# Altium schematic sheet ECAL-TEST-RIGHT-ISOLATION.SchDoc
size A; SheetNumber: 5; SheetTotal: 5
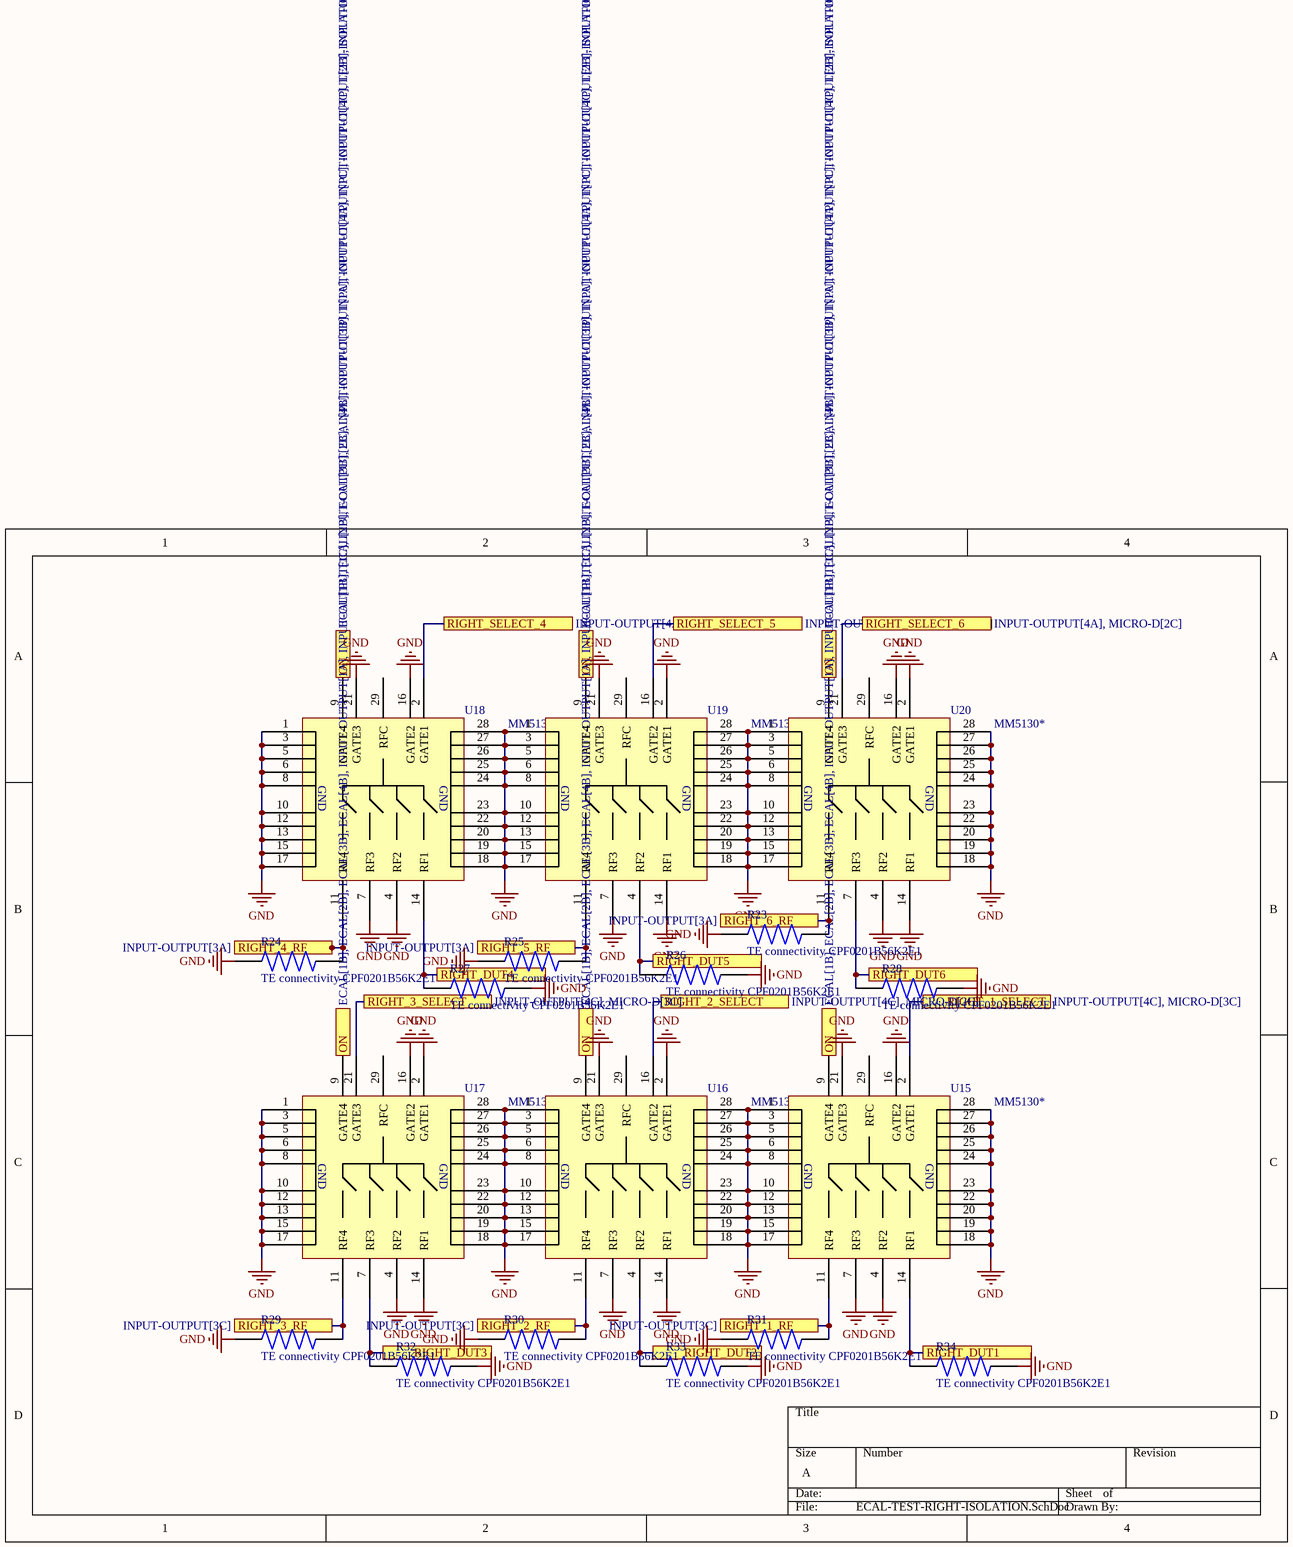
[diagram p0: ECAL-TEST-RIGHT-ISOLATION.SchDoc]

## Parts
R23  TE connectivity CPF0201B56K2E1  [0201-resistor]
R24  TE connectivity CPF0201B56K2E1  [0201-resistor]
R25  TE connectivity CPF0201B56K2E1  [0201-resistor]
R26  TE connectivity CPF0201B56K2E1  [0201-resistor]
R27  TE connectivity CPF0201B56K2E1  [0201-resistor]
R28  TE connectivity CPF0201B56K2E1  [0201-resistor]
R29  TE connectivity CPF0201B56K2E1  [0201-resistor]
R30  TE connectivity CPF0201B56K2E1  [0201-resistor]
R31  TE connectivity CPF0201B56K2E1  [0201-resistor]
R32  TE connectivity CPF0201B56K2E1  [0201-resistor]
R33  TE connectivity CPF0201B56K2E1  [0201-resistor]
R34  TE connectivity CPF0201B56K2E1  [0201-resistor]
U15  MM5130*  [MM5130-NORM_PCB_NOFLOOD]
U16  MM5130*  [MM5130-NORM_PCB_NOFLOOD]
U17  MM5130*  [MM5130-NORM_PCB_NOFLOOD]
U18  MM5130*  [MM5130-NORM_PCB_NOFLOOD]
U19  MM5130*  [MM5130-NORM_PCB_NOFLOOD]
U20  MM5130*  [MM5130-NORM_PCB_NOFLOOD]

## Ports
ON (see ECAL[1B], ECAL[2B], ECAL[3B], ECAL[4B], INPUT-OUTPUT[1A], INPUT-OUTPUT[1C], INPUT-OUTPUT[2B], INPUT-OUTPUT[3B], INPUT-OUTPUT[4A], INPUT-OUTPUT[4C], LEFT-ISOLATION[1A], LEFT-ISOLATION[1C], LEFT-ISOLATION[2A], LEFT-ISOLATION[2C], LEFT-ISOLATION[3A], LEFT-ISOLATION[3C], MICRO-D[2C], RIGHT-ISOLATION[2A], RIGHT-ISOLATION[2C], RIGHT-ISOLATION[3A]), ON (see ECAL[1B], ECAL[2B], ECAL[3B], ECAL[4B], INPUT-OUTPUT[1A], INPUT-OUTPUT[1C], INPUT-OUTPUT[2B], INPUT-OUTPUT[3B], INPUT-OUTPUT[4A], INPUT-OUTPUT[4C], LEFT-ISOLATION[1A], LEFT-ISOLATION[1C], LEFT-ISOLATION[2A], LEFT-ISOLATION[2C], LEFT-ISOLATION[3A], LEFT-ISOLATION[3C], MICRO-D[2C], RIGHT-ISOLATION[2A], RIGHT-ISOLATION[2C], RIGHT-ISOLATION[3A], RIGHT-ISOLATION[3C]), ON (see ECAL[1B], ECAL[2B], ECAL[3B], ECAL[4B], INPUT-OUTPUT[1A], INPUT-OUTPUT[1C], INPUT-OUTPUT[2B], INPUT-OUTPUT[3B], INPUT-OUTPUT[4A], INPUT-OUTPUT[4C], LEFT-ISOLATION[1A], LEFT-ISOLATION[1C], LEFT-ISOLATION[2A], LEFT-ISOLATION[2C], LEFT-ISOLATION[3A], LEFT-ISOLATION[3C], MICRO-D[2C], RIGHT-ISOLATION[2A], RIGHT-ISOLATION[2C], RIGHT-ISOLATION[3C]), RIGHT_1_RF (see INPUT-OUTPUT[3C]), RIGHT_1_SELECT (see INPUT-OUTPUT[4C], MICRO-D[3C]), RIGHT_2_RF (see INPUT-OUTPUT[3C]), RIGHT_2_SELECT (see INPUT-OUTPUT[4C], MICRO-D[2C]), RIGHT_3_RF (see INPUT-OUTPUT[3C]), RIGHT_3_SELECT (see INPUT-OUTPUT[4C], MICRO-D[3C]), RIGHT_4_RF (see INPUT-OUTPUT[3A]), RIGHT_5_RF (see INPUT-OUTPUT[3A]), RIGHT_6_RF (see INPUT-OUTPUT[3A]), RIGHT_DUT1, RIGHT_DUT2, RIGHT_DUT3, RIGHT_DUT4, RIGHT_DUT5, RIGHT_DUT6, RIGHT_SELECT_4 (see INPUT-OUTPUT[4A], MICRO-D[2C]), RIGHT_SELECT_5 (see INPUT-OUTPUT[4A], MICRO-D[3C]), RIGHT_SELECT_6 (see INPUT-OUTPUT[4A], MICRO-D[2C])

## Nets
GND: R23.1 R24.1 R25.1 R26.1 R27.1 R28.1 R29.1 R30.1 R31.1 R32.1 R33.1 R34.1 U15.1(GND) U15.3(GND) U15.4(RF2) U15.5(GND) U15.6(GND) U15.7(RF3) U15.8(GND) U15.10(GND) U15.12(GND) U15.13(GND) U15.15(GND) U15.16(GATE2) U15.17(GND) U15.18(GND) U15.19(GND) U15.20(GND) U15.21(GATE3) U15.22(GND) U15.23(GND) U15.24(GND) U15.25(GND) U15.26(GND) U15.27(GND) U15.28(GND) U16.1(GND) U16.2(GATE1) U16.3(GND) U16.5(GND) U16.6(GND) U16.7(RF3) U16.8(GND) U16.10(GND) U16.12(GND) U16.13(GND) U16.14(RF1) U16.15(GND) U16.17(GND) U16.18(GND) U16.19(GND) U16.20(GND) U16.21(GATE3) U16.22(GND) U16.23(GND) U16.24(GND) U16.25(GND) U16.26(GND) U16.27(GND) U16.28(GND) U17.1(GND) U17.2(GATE1) U17.3(GND) U17.4(RF2) U17.5(GND) U17.6(GND) U17.8(GND) U17.10(GND) U17.12(GND) U17.13(GND) U17.14(RF1) U17.15(GND) U17.16(GATE2) U17.17(GND) U17.18(GND) U17.19(GND) U17.20(GND) U17.22(GND) U17.23(GND) U17.24(GND) U17.25(GND) U17.26(GND) U17.27(GND) U17.28(GND) U18.1(GND) U18.3(GND) U18.4(RF2) U18.5(GND) U18.6(GND) U18.7(RF3) U18.8(GND) U18.10(GND) U18.12(GND) U18.13(GND) U18.15(GND) U18.16(GATE2) U18.17(GND) U18.18(GND) U18.19(GND) U18.20(GND) U18.21(GATE3) U18.22(GND) U18.23(GND) U18.24(GND) U18.25(GND) U18.26(GND) U18.27(GND) U18.28(GND) U19.1(GND) U19.2(GATE1) U19.3(GND) U19.5(GND) U19.6(GND) U19.7(RF3) U19.8(GND) U19.10(GND) U19.12(GND) U19.13(GND) U19.14(RF1) U19.15(GND) U19.17(GND) U19.18(GND) U19.19(GND) U19.20(GND) U19.21(GATE3) U19.22(GND) U19.23(GND) U19.24(GND) U19.25(GND) U19.26(GND) U19.27(GND) U19.28(GND) U20.1(GND) U20.2(GATE1) U20.3(GND) U20.4(RF2) U20.5(GND) U20.6(GND) U20.8(GND) U20.10(GND) U20.12(GND) U20.13(GND) U20.14(RF1) U20.15(GND) U20.16(GATE2) U20.17(GND) U20.18(GND) U20.19(GND) U20.20(GND) U20.22(GND) U20.23(GND) U20.24(GND) U20.25(GND) U20.26(GND) U20.27(GND) U20.28(GND)
ON: U15.9(GATE4) U16.9(GATE4) U17.9(GATE4) U18.9(GATE4) U19.9(GATE4) U20.9(GATE4) ; port ON
RIGHT_1_RF: R31.2 U15.11(RF4) ; port RIGHT_1_RF
RIGHT_1_SELECT: U15.2(GATE1) ; port RIGHT_1_SELECT
RIGHT_2_RF: R30.2 U16.11(RF4) ; port RIGHT_2_RF
RIGHT_2_SELECT: U16.16(GATE2) ; port RIGHT_2_SELECT
RIGHT_3_RF: R29.2 U17.11(RF4) ; port RIGHT_3_RF
RIGHT_3_SELECT: U17.21(GATE3) ; port RIGHT_3_SELECT
RIGHT_4_RF: R24.2 U18.11(RF4) ; port RIGHT_4_RF
RIGHT_5_RF: R25.2 U19.11(RF4) ; port RIGHT_5_RF
RIGHT_6_RF: R23.2 U20.11(RF4) ; port RIGHT_6_RF
RIGHT_DUT1: R34.2 U15.14(RF1) ; port RIGHT_DUT1
RIGHT_DUT2: R33.2 U16.4(RF2) ; port RIGHT_DUT2
RIGHT_DUT3: R32.2 U17.7(RF3) ; port RIGHT_DUT3
RIGHT_DUT4: R27.2 U18.14(RF1) ; port RIGHT_DUT4
RIGHT_DUT5: R26.2 U19.4(RF2) ; port RIGHT_DUT5
RIGHT_DUT6: R28.2 U20.7(RF3) ; port RIGHT_DUT6
RIGHT_SELECT_4: U18.2(GATE1) ; port RIGHT_SELECT_4
RIGHT_SELECT_5: U19.16(GATE2) ; port RIGHT_SELECT_5
RIGHT_SELECT_6: U20.21(GATE3) ; port RIGHT_SELECT_6

Not connected (* = marked no-connect by the designer): U15 29(RFC); U16 29(RFC); U17 29(RFC); U18 29(RFC); U19 29(RFC); U20 29(RFC)

## Library data of the parts
R23-R34 = TE connectivity CPF0201B56K2E1: CPF 0201 56K2 0.1% 25PPM 1K RL; MP: ERJ1GN0R00C; Value: 56k; Availability: Unavailable; Price: None; Package: None; Mfgr: TE connectivity; Mfgr Part No.: CPF0201B56K2E1
U15-U20 = IC-MM5130: High power SP4T MEMs switch